# EasyEDA schematic SCH_Logix3-Garage-Pad_2024-09-24.json
TITLE: Sheet_1; REV: 1.0; Date: 2021-01-31; Sheet: 1/1; Drawn By: mdegenaa; Company: Your Company
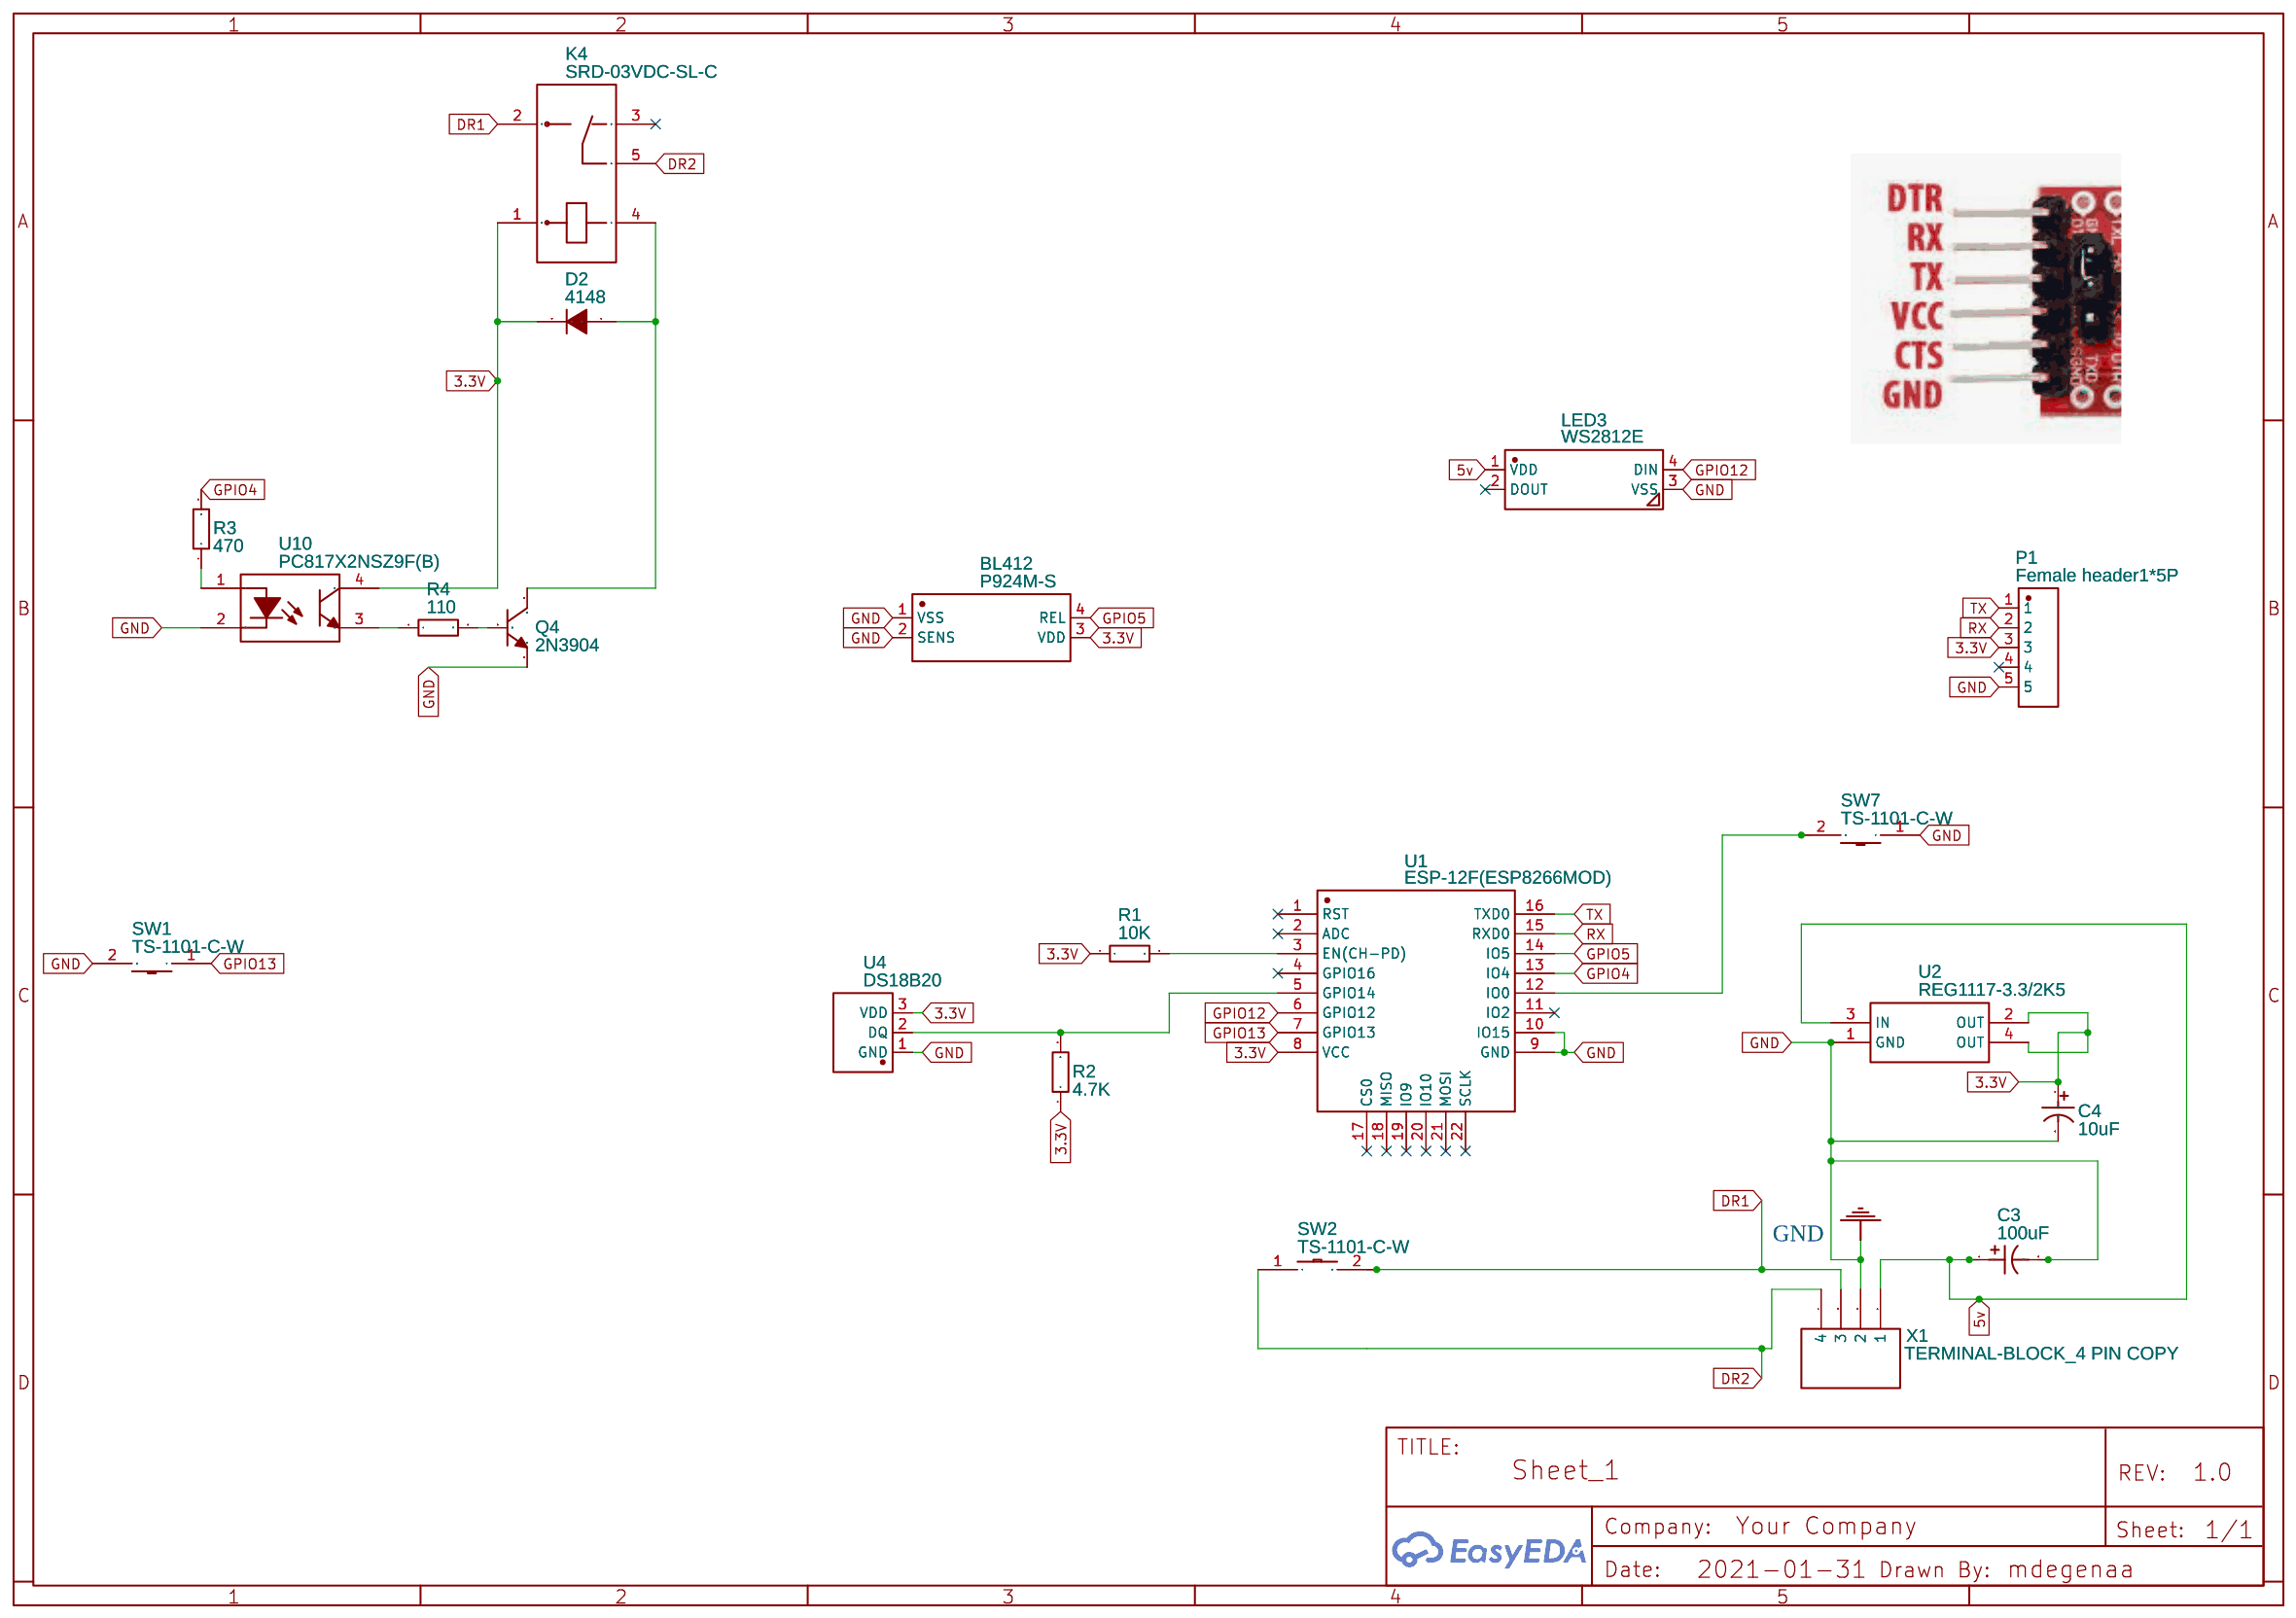
[diagram p0: schematic sheet]

## Parts
BL412  P924M-S  [PIR-TH_P924M-S]
C3  100uF  [CAP-SMD_BD5.0-L5.3-W5.3-LS6.0-FD]
C4  10uF  [CAP-SMD_BD4.0-L4.3-W4.3-FD]
D2  4148  [4148]
K4  SRD-03VDC-SL-C  [RELAY-TH_SRD-XXVDC-XL-C]
LED3  WS2812E  [LED-SMD_4P-L5.0-W5.0-BR]
P1  Female header1*5P  [HDR-TH_5P-P2.00-V-F-1]
Q4  2N3904  [TO-92-3_L5.1-W4.1-P1.27-L]
R1  10K  [R1206]
R2  4.7K  [R1206]
R3  470  [R1206]
R4  110  [R1206]
SW1  TS-1101-C-W  [SW-SMD_L6.0-W3.3-LS8.0]
SW2  TS-1101-C-W  [SW-SMD_L6.0-W3.3-LS8.0]
SW7  TS-1101-C-W  [SW-SMD_L6.0-W3.3-LS8.0]
U1  ESP-12F(ESP8266MOD)  [WIFIM-SMD_ESP-12F-ESP8266MOD]
U2  REG1117-3.3/2K5  [SOT-223_L6.5-W3.5-P2.30-LS7.0-BR]
U4  DS18B20  [TO-92-3_L4.9-W3.7-P1.27-L]
U10  PC817X2NSZ9F(B)  [DIP-4_L6.4-W4.6-P2.54-LS7.6-BL]
X1  TERMINAL-BLOCK_4 PIN COPY  [TERMINAL-BLOCK-4-PIN-3.5MM-LONG-PAD_PART2]

## Library data of the parts
BL412 = P924M-S: Supplier: LCSC; Manufacturer: Nicera; Contributor: LCSC; Supplier Part: C139580; JLCPCB Part Class: Extended Part
C3 = RVT100UF10V67RV0036: Supplier: LCSC; Supplier Part: C2891567; Manufacturer: KNSCHA(科尼盛); Contributor: LCSC
C4 = RVT1C100M0405_C72483: Supplier: LCSC; Manufacturer: ROQANG; Manufacturer Part: RVT1C100M0405; Supplier Part: C72483
D2 = 4148: Contributor: K n
K4 = SRD-03VDC-SL-C: Supplier: LCSC; Manufacturer: SONGLE; Supplier Part: C24585; JLCPCB Part Class: Extended Part
LED3 = WS2812E: Supplier: LCSC; Supplier Part: C139127; Manufacturer: Worldsemi; Contributor: LCSC; JLCPCB Part Class: Extended Part
P1 = Female header1*5P: Supplier: LCSC; Manufacturer: BOOMELE; Supplier Part: C66508; JLCPCB Part Class: Extended Part
Q4 = 2N3904: Supplier: LCSC; Manufacturer: SEMTECH; Supplier Part: C118538; JLCPCB Part Class: Extended Part
R1 = RMC120610K5%N: Supplier: LCSC; Supplier Part: C269752; Manufacturer: Tyohm; Contributor: LCSC; JLCPCB Part Class: Extended Part
R2 = RMC12064.7K5%N: Supplier: LCSC; Supplier Part: C269760; Manufacturer: Tyohm; Contributor: LCSC; JLCPCB Part Class: Extended Part
R3 = TC0625B4700T5E: Supplier: LCSC; Supplier Part: C95529; Manufacturer: Uniroyal Elec; Contributor: LCSC; JLCPCB Part Class: Extended Part
R4 = AECR1206F110RK9: Supplier: LCSC; Supplier Part: C352159; Manufacturer: ResistorToday; Contributor: LCSC
SW1 SW2 SW7 = TS-1101-C-W: Supplier: LCSC; Supplier Part: C318938; Manufacturer: XKB Connectivity(中国星坤); Contributor: LCSC; JLCPCB Part Class: Extended Part
U1 = ESP-12F(ESP8266MOD): Supplier: LCSC; Manufacturer: Ai-Thinker; Supplier Part: C82891
U2 = REG1117-3.3/2K5: Supplier: LCSC; Manufacturer: TI; Contributor: LCSC; Supplier Part: C139396; SMT Type: Extend; JLCPCB SMD: Yes
U4 = DS18B20: Supplier: LCSC; Supplier Part: C376006; Manufacturer: Youtai Semiconductor Co., Ltd.; Contributor: LCSC; JLCPCB Part Class: Extended Part
U10 = PC817X2NSZ9F(B): Supplier: LCSC; Manufacturer: SHARP; Supplier Part: C60965
X1 = TERMINAL-BLOCK_4 PIN COPY: Supplier Part: 277-1860-ND; Supplier: Digi-Key; Price: $0.83; sourceId: trJDVP7pi; Contributor: Spacehuepfer

## Nets
3.3V: BL412.3(VDD) C4.1 D2.2(K) K4.1 P1.3 R1.1 R2.1 U1.8(VCC) U2.2(OUT) U2.4(OUT) U4.3(VDD) U10.4
5v: C3.1 LED3.1(VDD) U2.3(IN) X1.1
GND: BL412.1(VSS) BL412.2(SENS) C3.2 C4.2 LED3.3(VSS) P1.5 Q4.1(E) SW1.2 SW7.1 U1.9(GND) U1.10(IO15) U2.1(GND) U4.1(GND) U10.2 X1.2
DR1: K4.2 SW2.2 X1.3
DR2: K4.5 SW2.1 X1.4
GPIO4: R3.2 U1.13(IO4)
GPIO5: BL412.4(REL) U1.14(IO5)
GPIO12: LED3.4(DIN) U1.6(GPIO12)
GPIO13: SW1.1 U1.7(GPIO13)
RX: P1.2 U1.15(RXD0)
TX: P1.1 U1.16(TXD0)
Net-(D2-1): D2.1(A) K4.4 Q4.3(C)
Net-(Q4-2): Q4.2(B) R4.2
Net-(R1-2): R1.2 U1.3(EN(CH-PD))
Net-(R2-2): R2.2 U1.5(GPIO14) U4.2(DQ)
Net-(R3-1): R3.1 U10.1
Net-(R4-1): R4.1 U10.3
Net-(SW7-2): SW7.2 U1.12(IO0)

Not connected (* = marked no-connect by the designer): K4 3*; LED3 2(DOUT)*; P1 4*; U1 1(RST)* 2(ADC)* 4(GPIO16)* 11(IO2)* 17(CS0)* 18(MISO)* 19(IO9)* 20(IO10)* 21(MOSI)* 22(SCLK)*
